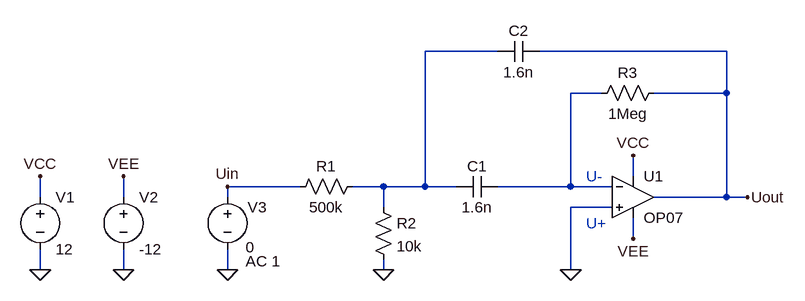
[diagram p0: schematic Sigfilter_OP07_template_b.asc]
Sigfilter_OP07_template_b.asc, the LTspice schematic file:
Version 4
SHEET 1 1040 680
WIRE 448 -208 336 -208
WIRE 800 -208 512 -208
WIRE 608 -144 560 -144
WIRE 800 -144 800 -208
WIRE 800 -144 688 -144
WIRE 656 -16 656 -48
WIRE 144 0 32 0
WIRE 272 0 224 0
WIRE 336 0 336 -208
WIRE 336 0 272 0
WIRE 384 0 336 0
WIRE 560 0 560 -144
WIRE 560 0 448 0
WIRE 624 0 560 0
WIRE -256 16 -256 -16
WIRE -128 16 -128 -16
WIRE 32 16 32 0
WIRE 800 16 800 -144
WIRE 800 16 688 16
WIRE 832 16 800 16
WIRE 272 32 272 0
WIRE 624 32 560 32
WIRE 656 80 656 48
WIRE -256 128 -256 96
WIRE -128 128 -128 96
WIRE 32 128 32 96
WIRE 272 128 272 112
WIRE 560 128 560 32
FLAG 32 128 0
FLAG 32 0 Uin
FLAG 832 16 Uout
FLAG -256 128 0
FLAG -128 128 0
FLAG -256 -16 VCC
FLAG -128 -16 VEE
FLAG 656 -48 VCC
FLAG 656 80 VEE
FLAG 560 128 0
FLAG 272 128 0
SYMBOL voltage 32 0 R0
WINDOW 0 31 32 Left 2
WINDOW 3 28 93 Left 2
WINDOW 123 28 115 Left 2
WINDOW 39 0 0 Left 0
SYMATTR InstName V3
SYMATTR Value 0
SYMATTR Value2 AC 1
SYMBOL voltage -256 0 R0
SYMATTR InstName V1
SYMATTR Value 12
SYMBOL voltage -128 0 R0
SYMATTR InstName V2
SYMATTR Value -12
SYMBOL cap 448 -16 R90
WINDOW 0 0 32 VBottom 2
WINDOW 3 32 32 VTop 2
SYMATTR InstName C1
SYMATTR Value 1.6n
SYMBOL cap 512 -224 R90
WINDOW 0 0 32 VBottom 2
WINDOW 3 32 32 VTop 2
SYMATTR InstName C2
SYMATTR Value 1.6n
SYMBOL res 240 -16 R90
WINDOW 0 0 56 VBottom 2
WINDOW 3 32 56 VTop 2
SYMATTR InstName R1
SYMATTR Value 500k
SYMBOL res 256 16 R0
SYMATTR InstName R2
SYMATTR Value 10k
SYMBOL res 704 -160 R90
WINDOW 0 0 56 VBottom 2
WINDOW 3 32 56 VTop 2
SYMATTR InstName R3
SYMATTR Value 1Meg
SYMBOL OpAmps/OP07 656 -48 R0
SYMATTR InstName U1
TEXT 584 -16 Left 2 ;U-
TEXT 584 56 Left 2 ;U+

The netlist it stands for:
* Sigfilter_OP07_template_b.asc
V3 Uin 0 0 AC 1
V1 VCC 0 12
V2 VEE 0 -12
C1 N002 N001 1.6n
C2 Uout N001 1.6n
R1 N001 Uin 500k
R2 N001 0 10k
R3 Uout N002 1Meg
XU1 0 N002 VCC VEE Uout LT1001  ; OP07, pins In+ In- V+ V- OUT
* U-
* U+
.lib LTC.lib
.backanno
.end